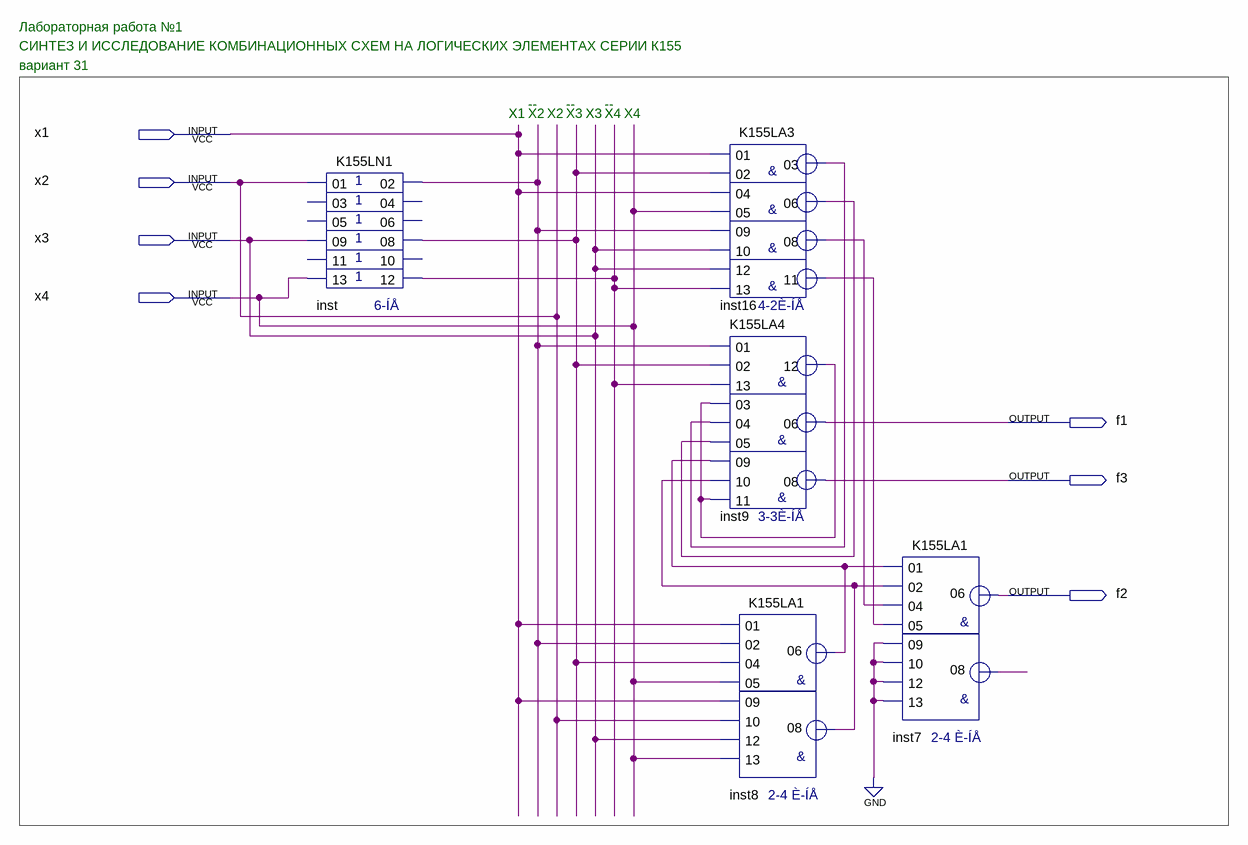
[diagram p0: schematic sheet]
// Quartus schematic ShemaK155.bdf as structural Verilog: 5 symbols, 7 pins
module ShemaK155 (
  input  x1,
  input  x2,
  input  x3,
  input  x4,
  output f1,
  output f3,
  output f2
);

  wire inst7_08, inst8_06, inst8_08, inst9_12, inst16_03, inst16_06, inst16_08, inst16_11, inst_02, inst_08,
       inst_12;

  K155LN1 inst (
    .\01 (x2), .\09 (x3), .\13 (x4), .\02 (inst_02), .\08 (inst_08), .\12 (inst_12));  // open: 03, 05, 11, 04, 06, 10
  K155LA3 inst16 (
    .\01 (x1), .\02 (inst_08), .\04 (x1), .\05 (x4), .\09 (inst_02), .\10 (x3), .\12 (x3), .\13 (inst_12),
    .\03 (inst16_03), .\06 (inst16_06), .\08 (inst16_08), .\11 (inst16_11));
  K155LA4 inst9 (
    .\01 (inst_02), .\02 (inst_08), .\13 (inst_12), .\03 (inst9_12), .\04 (inst16_03), .\05 (inst16_06),
    .\09 (inst8_06), .\10 (inst8_08), .\11 (inst9_12), .\12 (inst9_12), .\06 (f1), .\08 (f3));
  K155LA1 inst8 (
    .\01 (x1), .\02 (inst_02), .\04 (inst_08), .\05 (x4), .\09 (x1), .\10 (x2), .\12 (x3), .\13 (x4),
    .\06 (inst8_06), .\08 (inst8_08));
  K155LA1 inst7 (
    .\01 (inst8_06), .\02 (inst8_08), .\04 (inst16_08), .\05 (inst16_11), .\09 (1'b0), .\10 (1'b0),
    .\12 (1'b0), .\13 (1'b0), .\06 (f2), .\08 (inst7_08));

  // Notes on the sheet:
  //   Лабораторная работа №1
  //   СИНТЕЗ И ИССЛЕДОВАНИЕ КОМБИНАЦИОННЫХ СХЕМ НА ЛОГИЧЕСКИХ ЭЛЕМЕНТАХ СЕРИИ К155
  //   вариант 31
  //   --
  //   --
  //   --
  //   X1
  //   X2
  //   X2
  //   X3
  //   X3
  //   X4
  //   X4
endmodule
